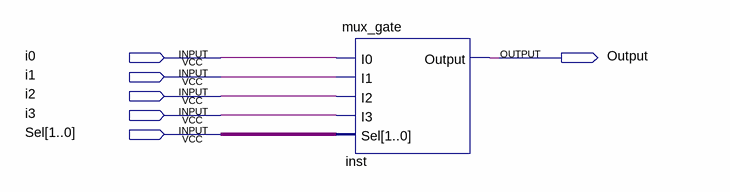
[diagram p0: schematic sheet]
// Quartus schematic VHDLmux.bdf as structural Verilog: 1 symbols, 6 pins
module VHDLmux (
  input  i0,
  input  i1,
  input  i2,
  input  i3,
  input  [1:0] Sel,
  output Output
);

  mux_gate inst (.I0(i0), .I1(i1), .I2(i2), .I3(i3), .Sel(Sel), .Output(Output));
endmodule
